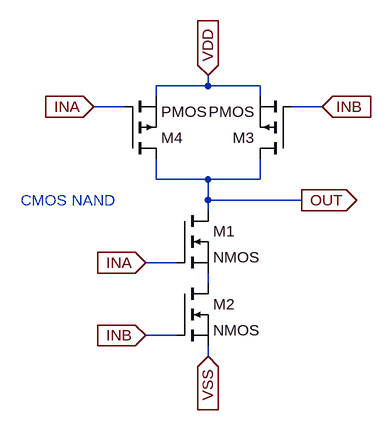
[diagram p0: schematic NAND.asc]
NAND.asc, the LTspice schematic file:
Version 4
SHEET 1 880 680
WIRE 176 -48 176 -64
WIRE 176 -48 96 -48
WIRE 256 -48 176 -48
WIRE 96 -32 96 -48
WIRE 256 -32 256 -48
WIRE 48 -16 0 -16
WIRE 352 -16 304 -16
WIRE 96 96 96 64
WIRE 176 96 96 96
WIRE 256 96 256 64
WIRE 256 96 176 96
WIRE 176 128 176 96
WIRE 320 128 176 128
WIRE 176 144 176 128
WIRE 128 224 80 224
WIRE 176 256 176 240
WIRE 128 336 80 336
WIRE 176 368 176 352
FLAG 176 368 VSS
IOPIN 176 368 In
FLAG 176 -64 VDD
IOPIN 176 -64 In
FLAG 320 128 OUT
IOPIN 320 128 Out
FLAG 0 -16 INA
IOPIN 0 -16 In
FLAG 80 224 INA
IOPIN 80 224 In
FLAG 80 336 INB
IOPIN 80 336 In
FLAG 352 -16 INB
IOPIN 352 -16 In
SYMBOL nmos 128 144 R0
SYMATTR InstName M1
SYMBOL nmos 128 256 R0
SYMATTR InstName M2
SYMBOL pmos 304 64 R180
SYMATTR InstName M3
SYMBOL pmos 48 64 M180
SYMATTR InstName M4
TEXT -112 128 Left 2 ;CMOS NAND

The netlist it stands for:
* NAND.asc
M1 OUT INA N001 N001 NMOS
M2 N001 INB VSS VSS NMOS
M3 OUT INB VDD VDD PMOS
M4 OUT INA VDD VDD PMOS
.model NMOS NMOS
.model PMOS PMOS
.lib standard.mos
* CMOS NAND
.backanno
.end